# EAGLE design Testboard_Cables (EAGLE 9.6.2)
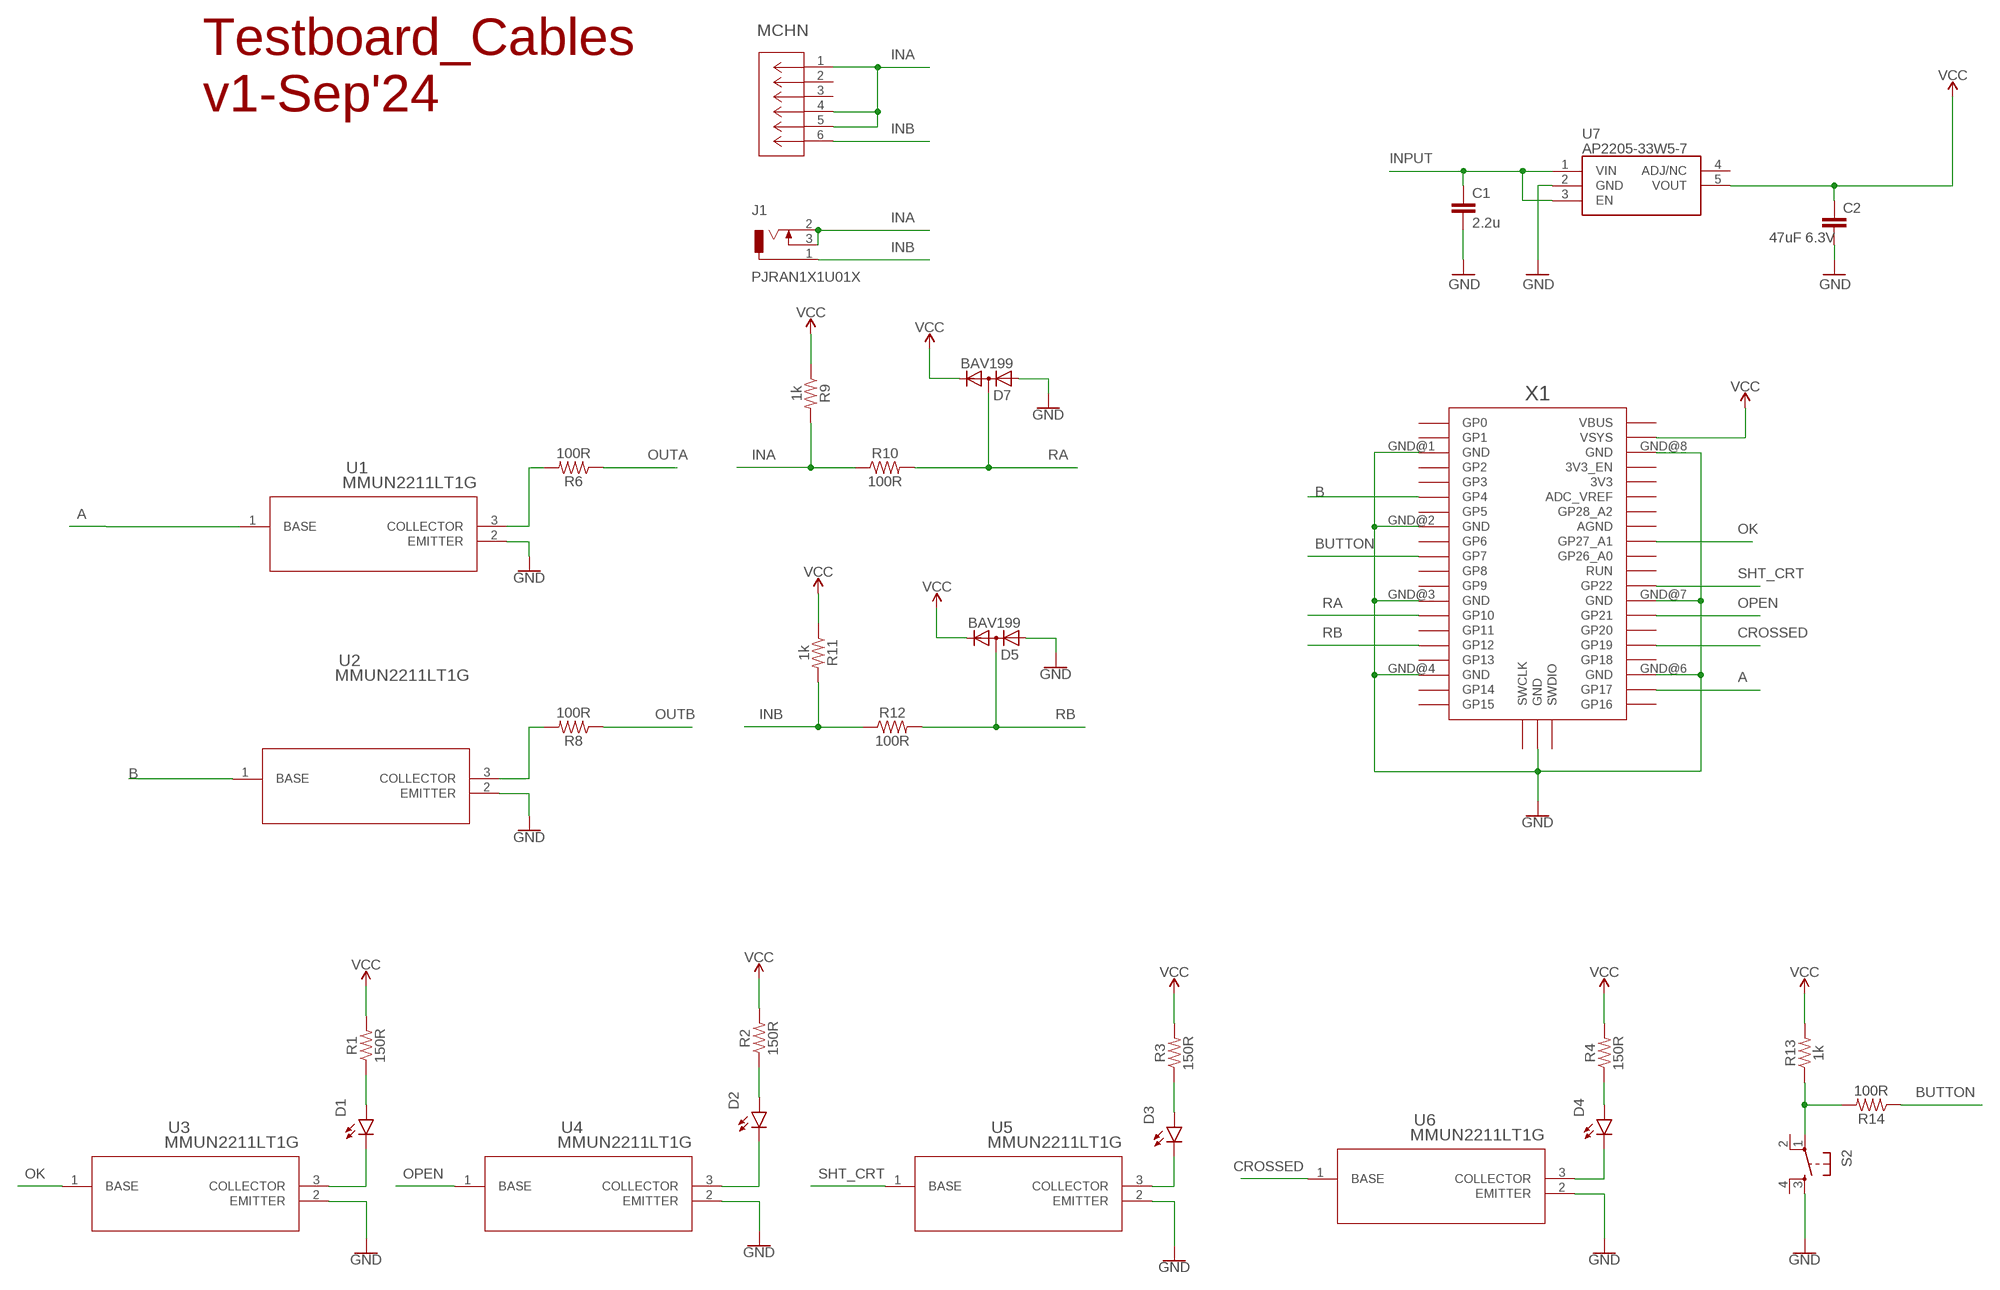
[diagram p0: schematic, sheet 1]

## Parts
C1  2.2u  4.7UF-6.3V-10%(0603)0603  [0603-CAP]
C2  47uF 6.3V  4.7UF-6.3V-10%(0603)0603  [0603-CAP]
D1  LED3MM  [LED_3MM]
D2  LED3MM  [LED_3MM]
D3  LED3MM  [LED_3MM]
D4  LED3MM  [LED_3MM]
D5  BAV199  [SOT23]
D7  BAV199  [SOT23]
J1  PJRAN1X1U01X  [PJRAN1X1U01X]
MCHN  ACJS-MHDR  [CONN_MHDR_AMP]
R1  150R  RESISTOR1206  [1206]
R2  150R  RESISTOR1206  [1206]
R3  150R  RESISTOR1206  [1206]
R4  150R  RESISTOR1206  [1206]
R6  100R  RESISTOR1206  [1206]
R8  100R  RESISTOR1206  [1206]
R9  1k  RESISTOR1206  [1206]
R10  100R  RESISTOR1206  [1206]
R11  1k  RESISTOR1206  [1206]
R12  100R  RESISTOR1206  [1206]
R13  1k  RESISTOR1206  [1206]
R14  100R  RESISTOR1206  [1206]
S2  TAC_SWITCH_KSC931G-SMD  [TAC_SW_SMD_KSC931G]
U1  MMUN2211LT1G  [SOT-23-3_1P4X3P040_ONS]
U2  MMUN2211LT1G  [SOT-23-3_1P4X3P040_ONS]
U3  MMUN2211LT1G  [SOT-23-3_1P4X3P040_ONS]
U4  MMUN2211LT1G  [SOT-23-3_1P4X3P040_ONS]
U5  MMUN2211LT1G  [SOT-23-3_1P4X3P040_ONS]
U6  MMUN2211LT1G  [SOT-23-3_1P4X3P040_ONS]
U7  AP2205-33W5-7  AP2205-W5-7  [SOT95P282X145-5N]
X1  RPI_PICO_IG-TH  [RPI_PICO_TH]

## Nets
A: U1.1(BASE) X1.GP17
B: U2.1(BASE) X1.GP4
BUTTON: R14.1 X1.GP7
CROSSED: U6.1(BASE) X1.GP19
GND: C1.2 C2.2 D5.1(A) D7.1(A) S2.3 U1.2(EMITTER) U2.2(EMITTER) U3.2(EMITTER) U4.2(EMITTER) U5.2(EMITTER) U6.2(EMITTER) U7.2(GND) X1.GND@1(GND) X1.GND@2(GND) X1.GND@3(GND) X1.GND@4(GND) X1.GND@5(GND) X1.GND@6(GND) X1.GND@7(GND) X1.GND@8(GND)
INA: J1.2 J1.3 MCHN.1 MCHN.4 MCHN.5 R9.2 R10.1
INB: J1.1 MCHN.6 R11.2 R12.1
INPUT: C1.1 U7.1(VIN) U7.3(EN)
N$1: D1.K(C) U3.3(COLLECTOR)
N$2: D1.A R1.1
N$3: R13.1 R14.2 S2.1
N$6: D2.K(C) U4.3(COLLECTOR)
N$7: D2.A R2.1
N$10: D3.K(C) U5.3(COLLECTOR)
N$11: D3.A R3.1
N$14: D4.K(C) U6.3(COLLECTOR)
N$15: D4.A R4.1
N$20: R6.2 U1.3(COLLECTOR)
N$21: R8.2 U2.3(COLLECTOR)
OK: U3.1(BASE) X1.GP27_A1
OPEN: U4.1(BASE) X1.GP21
OUTA: R6.1
OUTB: R8.1
RA: D7.3(AC) R10.2 X1.GP10
RB: D5.3(AC) R12.2 X1.GP12
SHT_CRT: U5.1(BASE) X1.GP22
VCC: C2.1 D5.2(C) D7.2(C) R1.2 R2.2 R3.2 R4.2 R9.1 R11.1 R13.2 U7.5(VOUT) X1.VSYS
Unconnected: MCHN.2 MCHN.3 S2.2 S2.4 U7.4(ADJ/NC) X1.3V3 X1.3V3_EN X1.ADC_VREF X1.AGND X1.GP0 X1.GP1 X1.GP2 X1.GP3 X1.GP5 X1.GP6 X1.GP8 X1.GP9 X1.GP11 X1.GP13 X1.GP14 X1.GP15 X1.GP16 X1.GP18 X1.GP20 X1.GP26_A0 X1.GP28_A2 X1.RUN X1.SWCLK X1.SWDIO X1.VBUS

## Notes on the sheet
- Testboard_Cables
  v1-Sep'24

## Library data of the parts
C1 C2 = SparkFun-Capacitors:4.7UF-6.3V-10%(0603): CAP-08280; PROD_ID: CAP-08280; VALUE: 4.7uF
D1-D4 = SparkFun-LED:LED: LED (Generic) Standard schematic elements and footprints for 5mm, 3mm, 1206, and 0603 sized LEDs. Generic LEDs with no color specified.; PROD_ID: DIO-08794
D5 D7 = diode:BAV199: DIODE low-leakage double diode
J1 = Connectors:PJRAN1X1U01X: CONN RCA JACK MONO 3.2MM R/A Manufacturer's datasheet <http://www.switchcraft.com/Drawings/pjran1x1u__x_series_cd.pdf>; CREATED_BY: PCBLayout.com; DIGIKEY_PART_NUMBER: PJRAN1X1U01X-ND; MANUFACTURER: Switchcraft Inc.; MPN: PJRAN1X1U01X
MCHN = ACJSMHDR_JACK:ACJS-MHDR; BUILT_BY: EMA_Matt; COPYRIGHT: Copyright (C) 2018 Accelerated Designs. All rights reserved; MANUFACTURER_PART_NUMBER: ACJS-MHDR; SOURCELIBRARY: Amphenol_2019-10-30; VENDOR: Amphenol
R1-R4 R6 R8-R14 = SparkFun-Resistors:RESISTOR: Generic Resistor Package
S2 = EDCPSU - Rev2:TAC_SWITCH: Momentary Switch Button commonly used for reset or general input. Spark Fun Electronics SKU : COM-00097 SMT- SWCH-08247
U1-U6 = MMUN2211LTG:MMUN2211LT1G; COPYRIGHT: Copyright (C) 2024 Ultra Librarian. All rights reserved.; MANUFACTURER_PART_NUMBER: MMUN2211LT1G; MFR_NAME: onsemi
U7 = AP2205-W5-7:AP2205-W5-7: LDO Voltage Regulators LDO CMOS LowCurr Source: Datasheet <https://www.diodes.com/assets/Datasheets/AP2206.pdf>; DESCRIPTION: LDO Voltage Regulators LDO CMOS LowCurr; HEIGHT: 1.45mm; MANUFACTURER_NAME: Diodes Inc.; MANUFACTURER_PART_NUMBER: AP2205-W5-7; MOUSER_PART_NUMBER: 621-AP2205-W5-7; MOUSER_PRICE-STOCK: https://www.mouser.com/Search/Refine.aspx?Keyword=621-AP2205-W5-7
X1 = RaspberryPi_Pico:RPI_PICO_IG

## Net classes
2 gnd: width 0.305 mm, drill 0.483 mm, clearance 0.203 mm

## Board
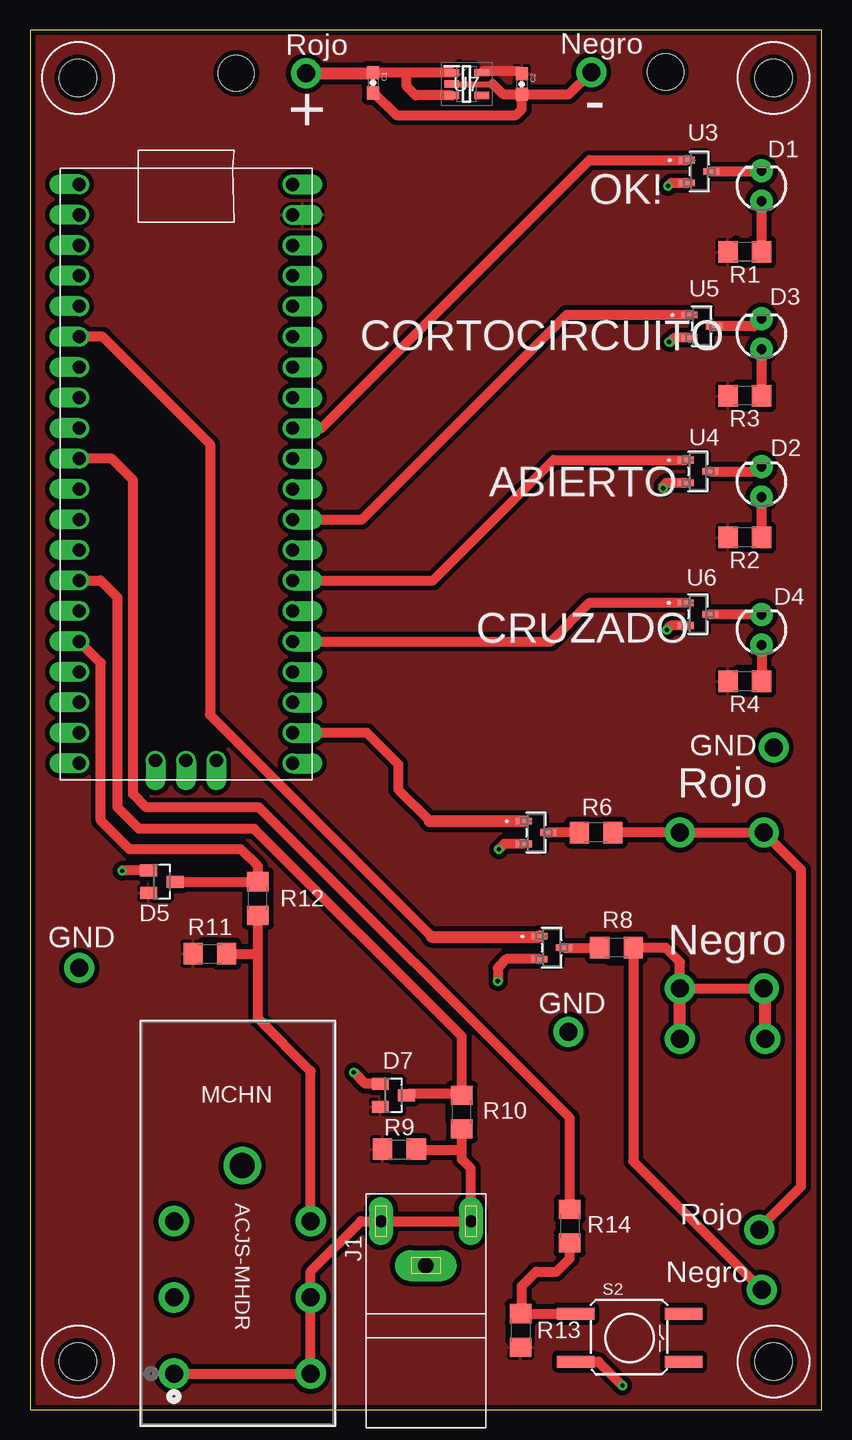
[diagram p1: board, top side]
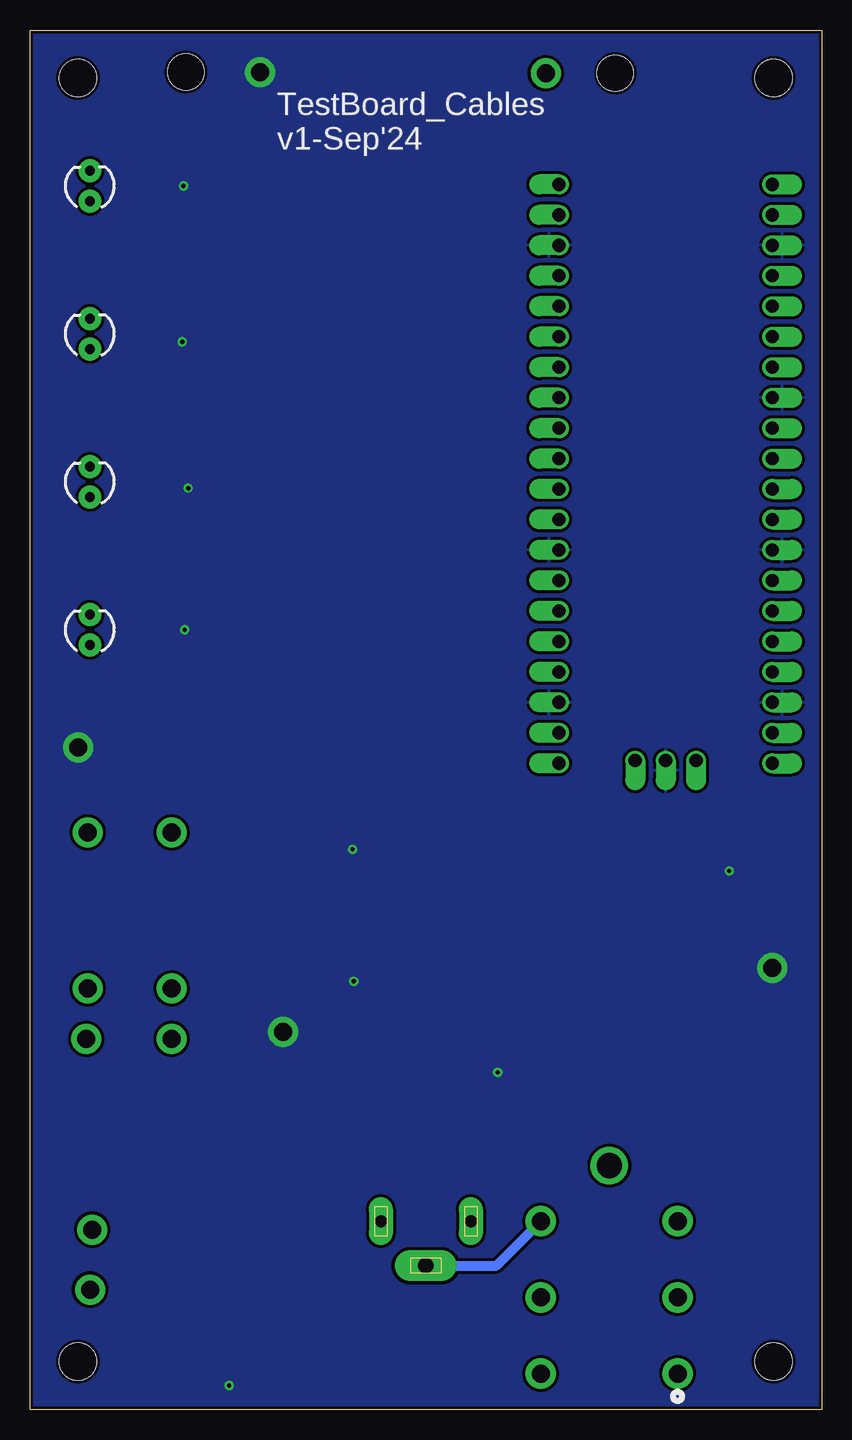
[diagram p2: board, bottom side, seen from below]

Size 66 x 115 mm. Coordinates in mm from the lower left corner, seen from the top.
Outline: 0,0 66,0 66,115 0,115 0,0
Copper layers (1*16): Top 0.035mm / dielectric 1.5mm / Bottom 0.035mm
Design rules "default *": minimum track width 6mil, minimum drill 0.35mm, track to track 8mil, track to pad 8mil, pad to pad 8mil, via to via 8mil, smd to smd 0mil, copper to edge 10mil, drill to drill 8mil, minimum pad ring 10mil, minimum via ring 8mil, stop-mask expansion 4mil, vias tented up to drill 0mil, thermal gap 10mil
Holes 3.1 mm at 4,4 62,4 62,111 4,111
Holes 3 mm at 17.2,111.4 53,111.5
tRestrict: area 55.3,101.9 to 56.3,104.7; area 55.4,88.9 to 56.6,91.8; area 55.1,76.8 to 56.3,79.6; area 55.1,64.9 to 56.3,67.7; area 59,59.9 to 60.2,61.6; area 41.6,46.7 to 42.8,49.5; area 42.9,37.1 to 44.1,39.9; area 29.7,24.9 to 30.9,27.5; area 10.4,42.7 to 11.5,45.3; area 35.8,111.1 to 37,112.1; area 18.2,41.8 to 19.8,43.6; area 14.4,37.3 to 15.7,38.9; 10 more areas

### Footprints (pad centres in the part's own frame; a part is rotated, then mirrored left to right if it is on the bottom)
0603-CAP = smd 1.1 x 1: 1 -0.85,0; 2 0.85,0
LED_3MM = drill 0.813 pad 1.88: A -1.27,0; K 1.27,0
SOT23 = smd 1 x 1.4: 1 -0.95,-1.1; 2 0.95,-1.1; 3 0,1.1
PJRAN1X1U01X = drill 1.3 pad 2.6 long: 1 0,0 | drill 1 pad 2 long: 2 3.75,3.7; 3 -3.75,3.7
CONN_MHDR_AMP = drill 1.5 pad 2.54: 1 0,0; 2 -6.35,0; 3 -12.7,0; 4 0,11.405; 5 -6.35,11.405; 6 -12.7,11.405 | drill 2.108 pad 2.616: 7 -17.323,5.69
1206 = smd 1.6 x 1.8: 1 -1.4,0; 2 1.4,0
TAC_SW_SMD_KSC931G = smd 3.1 x 1: 1 -4.5,2; 2 4.5,2; 3 -4.5,-2; 4 4.5,-2
SOT-23-3_1P4X3P040_ONS = smd 0.559 x 1.321: 1 -0.953,-1.016; 2 0.953,-1.016; 3 0,1.016
SOT95P282X145-5N = smd 1.2 x 0.6: 1 -1.25,0.95; 2 -1.25,0; 3 -1.25,-0.95; 4 1.25,-0.95; 5 1.25,0.95
RPI_PICO_TH = drill 1.1 pad 1.6 offset: 3V3 8.89,13.97; 3V3_EN 8.89,16.51; ADC_VREF 8.89,11.43; AGND 8.89,6.35; GND@1 -8.89,19.05; GND@2 -8.89,6.35; GND@3 -8.89,-6.35; GND@4 -8.89,-19.05; GND@5 0,-23.9; GND@6 8.89,-19.05; GND@7 8.89,-6.35; GND@8 8.89,19.05; GP0 -8.89,24.13; GP1 -8.89,21.59; GP2 -8.89,16.51; GP3 -8.89,13.97; GP4 -8.89,11.43; GP5 -8.89,8.89; GP6 -8.89,3.81; GP7 -8.89,1.27; GP8 -8.89,-1.27; GP9 -8.89,-3.81; GP10 -8.89,-8.89; GP11 -8.89,-11.43; GP12 -8.89,-13.97; GP13 -8.89,-16.51; GP14 -8.89,-21.59; GP15 -8.89,-24.13; GP16 8.89,-24.13; GP17 8.89,-21.59; GP18 8.89,-16.51; GP19 8.89,-13.97; GP20 8.89,-11.43; GP21 8.89,-8.89; GP22 8.89,-3.81; GP26_A0 8.89,1.27; GP27_A1 8.89,3.81; GP28_A2 8.89,8.89; RUN 8.89,-1.27; SWCLK -2.54,-23.9; SWDIO 2.54,-23.9; VBUS 8.89,24.13; VSYS 8.89,21.59

### Placement (x,y rotation side)
C1  28.6,110.6 270 top
C2  41,110.5 270 top
D1  61,102 90 top
D2  61,77.33 90 top
D3  61,89.67 90 top
D4  61,65 90 top
D5  11,44 270 top
D7  30.3,26.2 270 top
J1  33,12 0 top
MCHN  12,3 270 top
R1  59.6,96.5 180 top
R2  59.6,72.7 180 top
R3  59.6,84.5 180 top
R4  59.6,60.7 180 top
R6  47.2,48.1 180 top
R8  48.9,38.5 180 top
R9  30.8,21.7 0 top
R10  36,24.8 90 top
R11  15,38 0 top
R12  19,42.6 90 top
R13  40.9,6.6 270 top
R14  45,15.3 270 top
S2  50,6 0 top
U1  42.2,48.1 270 top
U2  43.5,38.5 270 top
U3  55.8,103.2 270 top
U4  55.7,78.2 270 top
U5  56,90.3 270 top
U6  55.7,66.3 270 top
U7  36.4,110.5 0 top
X1  13,78 0 top

### Tracks (layer width: path | path; a pad name or v marks a point on that pad's centre or on a via)
A
  Top 0.813: 33.35,49.05 30.7,51.7 30.7,53.8 28.09,56.41 X1.GP17
  Top 1.016: 33.35,49.05 U1.1
B
  Top 0.813: X1.GP4 6.07,89.43 15,80.5 15,57.9 33.5,39.4
  Top 1.016: 33.5,39.4 42.43,39.4 U2.1
BUTTON
  Top 0.813: R14.1 45,24.3 19.1,50.2 9.7,50.2 8.6,51.3 8.6,77.5 6.83,79.27 X1.GP7
CROSSED
  Top 0.813: X1.GP19 43.43,64.03 46.65,67.25 U6.1
GND  (via drill 0.35, 1.5 pad 2.5)
  Top 0.508: U7.2 38.6,110.5
  Top 0.813: D5.1 7.75,44.95 v7.7,44.9 | D7.1 27.95,27.15 v27,28.1 | U2.2 39.75,37.55 39,36.8 v39,35.7 | U1.2 39.55,47.15 v39.1,46.7 | U6.2 53.45,65.35 v53.1,65 | v52.8,76.8 52.8,77 53.05,77.25 U4.2 | U5.2 53.75,89.35 53.4,89 v53.3,89 | U3.2 53.45,102.25 v53.2,102 | v49.4,2 47.4,4 S2.3 | C2.2 39.45,109.65 38.6,110.5 | C2.2 44.95,109.65 v46.8,111.5 | C1.2 28.7,109.75 30.55,107.9 40.5,107.9 41,108.4 C2.2
  other vias: 44.9,31.5 62,55.2 4.1,36.8
  pour Bottom (isolate 0.254): -2,117 68,117 68,-4.2 -2,-4.2
INA
  Top 0.813: 36,21.6 36,22.6 R10.1 | 36,21.6 32.3,21.6 R9.2 | MCHN.1 MCHN.4 MCHN.5 23.41,11.51 27.6,15.7 J1.3 J1.2 36.75,20.1 36,20.85 36,21.6
INB
  Top 0.813: MCHN.6 23.41,28.2 19,32.6 19,38.2 | 19,38.2 R12.1 | R11.2 18.8,38 19,38.2
  Bottom 0.813: J1.1 27.1,12 MCHN.6
INPUT  (via drill 1.5 pad 2.5)
  Top 0.813: U7.1 31.4,111.45 | 31.4,111.45 C1.1 | U7.3 32.15,109.55 31.4,110.3 31.4,111.45
  Top 1.016: v23,111.4 28.55,111.4 C1.1
N$1
  Top 0.813: D1.K 60.93,103.2 U3.3
N$2
  Top 0.813: R1.1 D1.A
N$3
  Top 0.813: S2.1 R13.1 41,8.1 41,10.3 42.2,11.5 43.9,11.5 45,12.6 R14.2
N$6
  Top 0.813: U4.3 60.6,78.2 D2.K
N$7
  Top 0.813: R2.1 D2.A
N$10
  Top 0.813: D3.K 60.36,90.3 U5.3
N$11
  Top 0.813: R3.1 D3.A
N$14
  Top 0.813: U6.3 60.97,66.3 D4.K
N$15
  Top 0.813: D4.A R4.1
N$20
  Top 0.813: R6.2 U1.3
N$21
  Top 0.813: U2.3 R8.2
OK
  Top 0.813: X1.GP27_A1 24.31,81.81 46.65,104.15 U3.1
OPEN
  Top 0.813: X1.GP21 33.61,69.11 43.65,79.15 U4.1
OUTA  (via drill 1.5 pad 2.5)
  Top 0.813: R6.1 v54.2,48.1 v61.2,48.1 64.3,45 64.3,18.6 60.8,15.1 v60.8,15
OUTB  (via drill 1.5 pad 2.5)
  Top 0.813: v61.2,35.1 v54.2,35.1 54.2,37.3 53,38.5 R8.1 50.3,20.7 v61,10
  Top 1.016: v54.2,30.9 v54.2,35.1 | v61.3,30.9 61.3,35 v61.2,35.1
RA
  Top 0.813: D7.3 31.5,26.3 35.9,26.3 R10.2 36,31.1 18.7,48.4 9.1,48.4 7.3,50.2 7.3,67.7 5.89,69.11 X1.GP10
RB
  Top 0.813: D5.3 R12.2 19,45.3 17.6,46.7 8.3,46.7 5.9,49.1 5.9,62.24 X1.GP12
SHT_CRT
  Top 0.813: X1.GP22 27.69,74.19 44.75,91.25 U5.1
VCC
  Top 0.508: U7.5 37.75,111.55
  Top 0.813: 37.75,111.55 40.8,111.55 C2.1
  pour Top (isolate 0.406): -2,117 68,117 68,-3.8 -2,-3.8

### Text on the board
tPlace: OK! | CORTOCIRCUITO | ABIERTO | CRUZADO
bPlace: TestBoard_Cables / v1-Sep'24
tNames: Rojo | Negro | + | - | GND | Rojo | GND | Negro | GND | Rojo | Negro